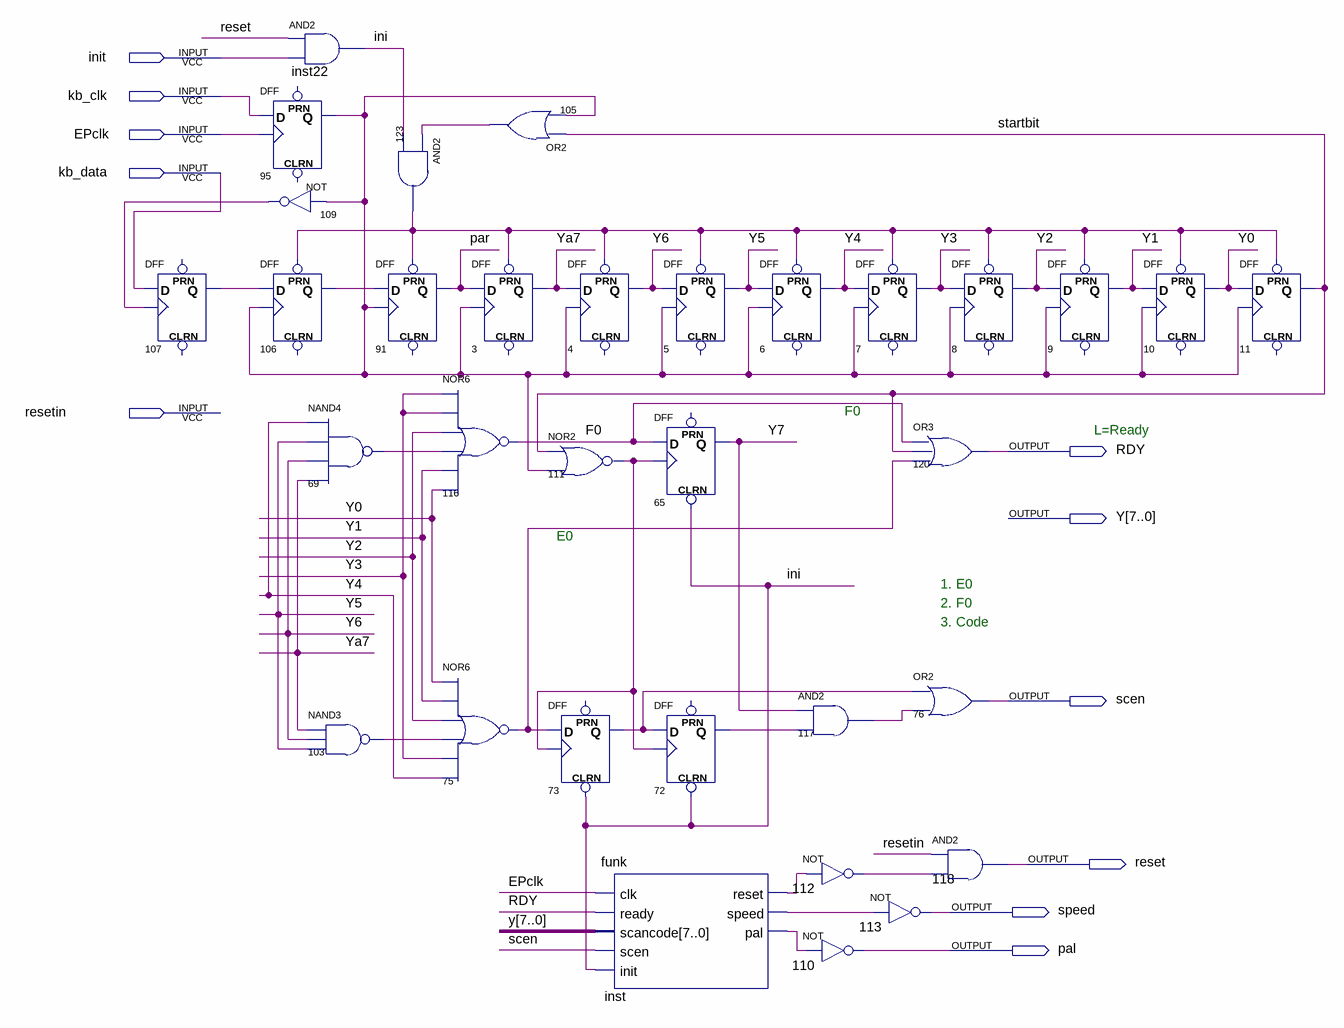
[diagram p0: schematic sheet]
// Quartus schematic KBSCAN.bdf as structural Verilog: 33 symbols, 11 pins
module KBSCAN (
  input  init,
  input  kb_clk,
  input  EPclk,
  input  kb_data,
  input  resetin,
  output RDY,
  output [7:0] Y,
  output scen,
  output reset,
  output speed,
  output pal
);

  wire F0, ini, inst_pal, inst_reset, inst_speed, n69_out, n72_q, n73_q, n75_out, n95_q, n103_out, n105_out,
       n106_q, n107_q, n109_out, n111_out, n112_out, n117_out, n123_out, par, startbit, Ya7;

  DFF u_107 (.CLK(n109_out), .D(kb_data), .Q(n107_q));  // open: CLRN, PRN
  DFF u_95 (.CLK(EPclk), .D(kb_clk), .Q(n95_q));  // open: CLRN, PRN
  not u_109 (n109_out, n95_q);
  DFF u_106 (.CLK(n95_q), .D(n107_q), .PRN(n123_out), .Q(n106_q));  // open: CLRN
  and inst22 (ini, reset, init);
  nand u_69 (n69_out, Y[4], Y[5], Y[6], Ya7);
  nand u_103 (n103_out, Ya7, Y[6], Y[5]);
  and u_123 (n123_out, n105_out, ini);
  DFF u_91 (.CLK(n95_q), .D(n106_q), .PRN(n123_out), .Q(par));  // open: CLRN
  or u_105 (n105_out, startbit, n95_q);
  DFF u_3 (.CLK(n95_q), .D(par), .PRN(n123_out), .Q(Ya7));  // open: CLRN
  nor u_116 (F0, Y[3], Y[3], Y[2], n69_out, Y[1], Y[0]);
  nor u_75 (n75_out, Y[0], Y[1], Y[2], n103_out, Y[3], Y[4]);
  DFF u_4 (.CLK(n95_q), .D(Ya7), .PRN(n123_out), .Q(Y[6]));  // open: CLRN
  nor u_111 (n111_out, startbit, n95_q);
  DFF u_73 (.CLRN(ini), .CLK(n111_out), .D(n75_out), .Q(n73_q));  // open: PRN
  DFF u_5 (.CLK(n95_q), .D(Y[6]), .PRN(n123_out), .Q(Y[5]));  // open: CLRN
  DFF u_65 (.CLRN(ini), .CLK(n111_out), .D(F0), .Q(Y[7]));  // open: PRN
  DFF u_72 (.CLRN(ini), .CLK(n111_out), .D(n73_q), .Q(n72_q));  // open: PRN
  funk inst (
    .clk(EPclk), .ready(RDY), .scancode(Y), .scen(scen), .init(ini), .reset(inst_reset), .speed(inst_speed),
    .pal(inst_pal));
  DFF u_6 (.CLK(n95_q), .D(Y[5]), .PRN(n123_out), .Q(Y[4]));  // open: CLRN
  and u_117 (n117_out, Y[7], n72_q);
  not u_112 (n112_out, inst_reset);
  not u_110 (pal, inst_pal);
  DFF u_7 (.CLK(n95_q), .D(Y[4]), .PRN(n123_out), .Q(Y[3]));  // open: CLRN
  not u_113 (speed, inst_speed);
  DFF u_8 (.CLK(n95_q), .D(Y[3]), .PRN(n123_out), .Q(Y[2]));  // open: CLRN
  or u_120 (RDY, F0, startbit, n75_out);
  or u_76 (scen, n73_q, n117_out);
  and u_118 (reset, resetin, n112_out);
  DFF u_9 (.CLK(n95_q), .D(Y[2]), .PRN(n123_out), .Q(Y[1]));  // open: CLRN
  DFF u_10 (.CLK(n95_q), .D(Y[1]), .PRN(n123_out), .Q(Y[0]));  // open: CLRN
  DFF u_11 (.CLK(n95_q), .D(Y[0]), .PRN(n123_out), .Q(startbit));  // open: CLRN

  // Notes on the sheet:
  //   F0
  //   L=Ready
  //   E0
  //   1. E0
  //   2. F0
  //   3. Code
endmodule
